# Altium schematic sheet frm-voltrod_4LED.SchDoc: 4LED COMPARATOR
size A3; Organization: Altium Limited; Address1: L3, 12a Rodborough Rd; Address2: Frenchs Forest; Address3: NSW; Address4: Australia 2086; DocumentNumber: 3; SheetNumber: 3; SheetTotal: 4
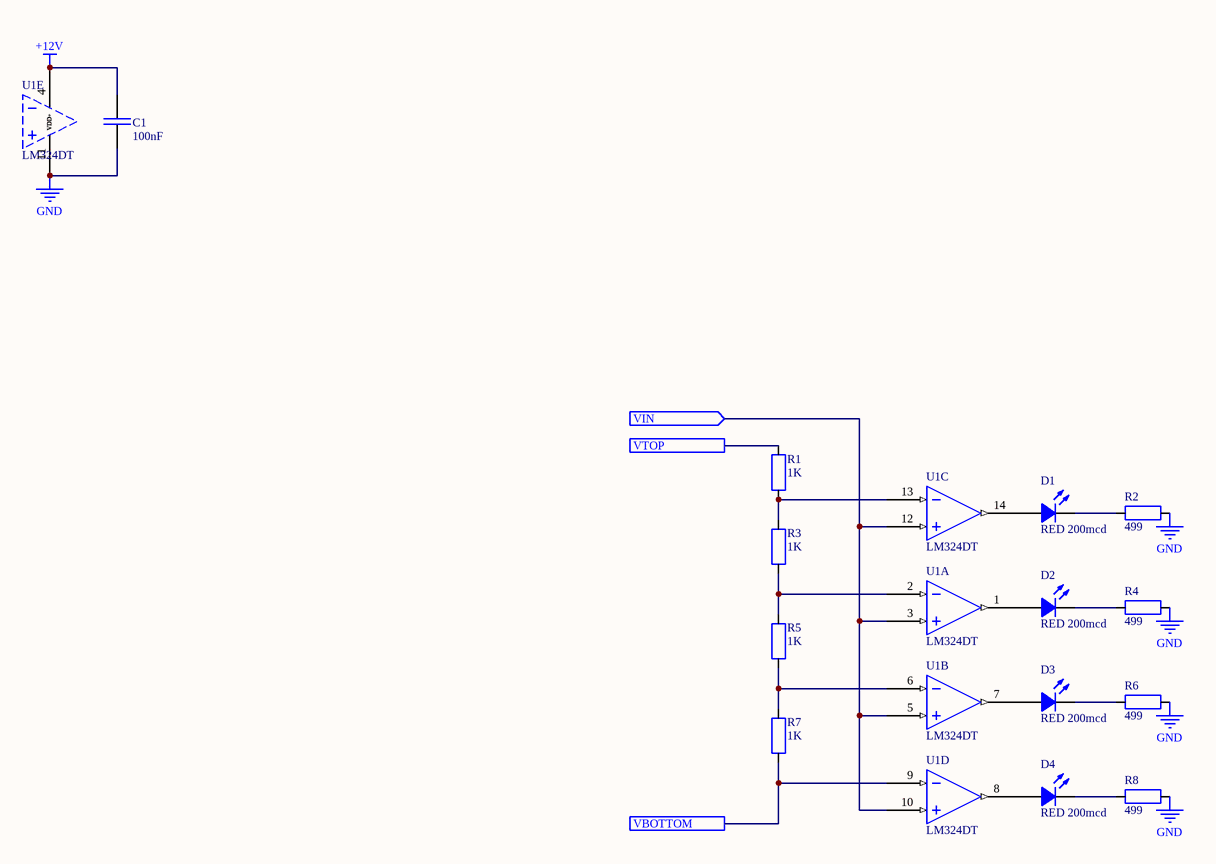
[diagram p0: frm-voltrod_4LED.SchDoc]

## Parts
C1  100nF  [CAP 0603_1608]
D1  RED 200mcd  [ED49B4F6-595F-4D62-96BB-D7184CAA9B94]
D2  RED 200mcd  [ED49B4F6-595F-4D62-96BB-D7184CAA9B94]
D3  RED 200mcd  [ED49B4F6-595F-4D62-96BB-D7184CAA9B94]
D4  RED 200mcd  [ED49B4F6-595F-4D62-96BB-D7184CAA9B94]
R1  1K  [RES 0603_1608]
R2  499  [RES 1206_3216]
R3  1K  [RES 0603_1608]
R4  499  [RES 1206_3216]
R5  1K  [RES 0603_1608]
R6  499  [RES 1206_3216]
R7  1K  [RES 0603_1608]
R8  499  [RES 1206_3216]
U1  LM324DT  [34355DA5-B1DA-47C2-A88A-ECF82120A4F7]  (parts A,B,C,D,E of 5)

## Ports
VBOTTOM, VIN (in), VTOP

## Nets
+12V: C1.1 U1.4(VDD+)
GND: C1.2 R2.2 R4.2 R6.2 R8.2 U1.11(VDD-)
VBOTTOM: R7.2 U1.9(IN-) ; port VBOTTOM
VIN: U1.3(IN+) U1.5(IN+) U1.10(IN+) U1.12(IN+) ; port VIN
VTOP: R1.1 ; port VTOP
NetD1_1: D1.1(K) R2.1
NetD1_2: D1.2(A) U1.14(OUT)
NetD2_1: D2.1(K) R4.1
NetD2_2: D2.2(A) U1.1(OUT)
NetD3_1: D3.1(K) R6.1
NetD3_2: D3.2(A) U1.7(OUT)
NetD4_1: D4.1(K) R8.1
NetD4_2: D4.2(A) U1.8(OUT)
NetR1_2: R1.2 R3.1 U1.13(IN-)
NetR3_2: R3.2 R5.1 U1.2(IN-)
NetR5_2: R5.2 R7.1 U1.6(IN-)

## Notes on the sheet
- Title
- Fermium LABS srl
- Size:
- Date:
- File:
- A4
- Prj
- Time:
- Sheet
- of
- Via Monselice 15a
- 35142 Padova PD
- Italy
- Git Hash:

## Library data of the parts
C1 = 02841f84-ac15-41b5-9e17-915f8f067828: CAP SMD MLCC 100nF 25V 0603 X7R; Manufacturer 1: Samsung Electro-Mechanics; Manufacturer Part Number 1: CL10B104KA8NNNC; id: 14784; S 1: LCSC; SPN 1: C1590; Part Number: 02841f84-ac15-41b5-9e17-915f8f067828; ComponentLink1Description: Datasheet; ComponentLink1URL: http://localhost:8080/static/files/Samsung-Electro-Mechanics-CL10B104KA8NNNC_C15902019-03-10_215548.826887.pdf?Samsung-Electro-Mechanics-CL10B104KA8NNNC_C1590.pdf; Value: 100nF
D1-D4 = c65ae3d2-9539-4634-8979-616a331b7494: DIODE LED THT 5MM RED 200mcd; Manufacturer 1: Everlight; Manufacturer Part Number 1: 333-2SURD/S530-A3-L; id: 14851; S 1: LCSC; SPN 1: C99758; Part Number: c65ae3d2-9539-4634-8979-616a331b7494; ComponentLink1Description: Datasheet; ComponentLink1URL: http://localhost:8080/static/files/Everlight-Elec-333-2SURD-S530-A3-L_C997582019-08-18_181624.501044.pdf?Everlight-Elec-333-2SURD-S530-A3-L_C99758.pdf; Value: RED 200mcd
R1 R3 R5 R7 = a678220f-9e9d-4863-a833-9993504f723c: RES SMD 1K OHM 1% 1/10W 0603; Manufacturer 1: Yageo; Manufacturer Part Number 1: RC0603FR-071KL; id: 14794; S 1: LCSC; SPN 1: C22548; Part Number: a678220f-9e9d-4863-a833-9993504f723c; Value: 1K
R2 R4 R6 R8 = c8bf8de8-3430-48dd-94ac-a027709c0c4f: RES SMD 499 OHM 1% 1/4W 1206; Manufacturer 1: Yageo; Manufacturer Part Number 1: RC1206FR-07499RL; id: 14010; S 1: LCSC; SPN 1: C137267; Part Number: c8bf8de8-3430-48dd-94ac-a027709c0c4f; Value: 499
U1 = 21a85167-c328-42f7-a52e-365842c6dad3: IC SMD OPAMP LM324DT SO-14; Manufacturer 1: ST Microelectronics; id: 14792; S 1: LCSC; SPN 1: C71035; Part Number: 21a85167-c328-42f7-a52e-365842c6dad3; ComponentLink1Description: Datasheet; ComponentLink1URL: http://localhost:8080/static/files/STMicroelectronics-LM324DT_C710352019-04-06_191500.254110.pdf?STMicroelectronics-LM324DT_C71035.pdf; Manufacturer Part Number 1: LM324DT